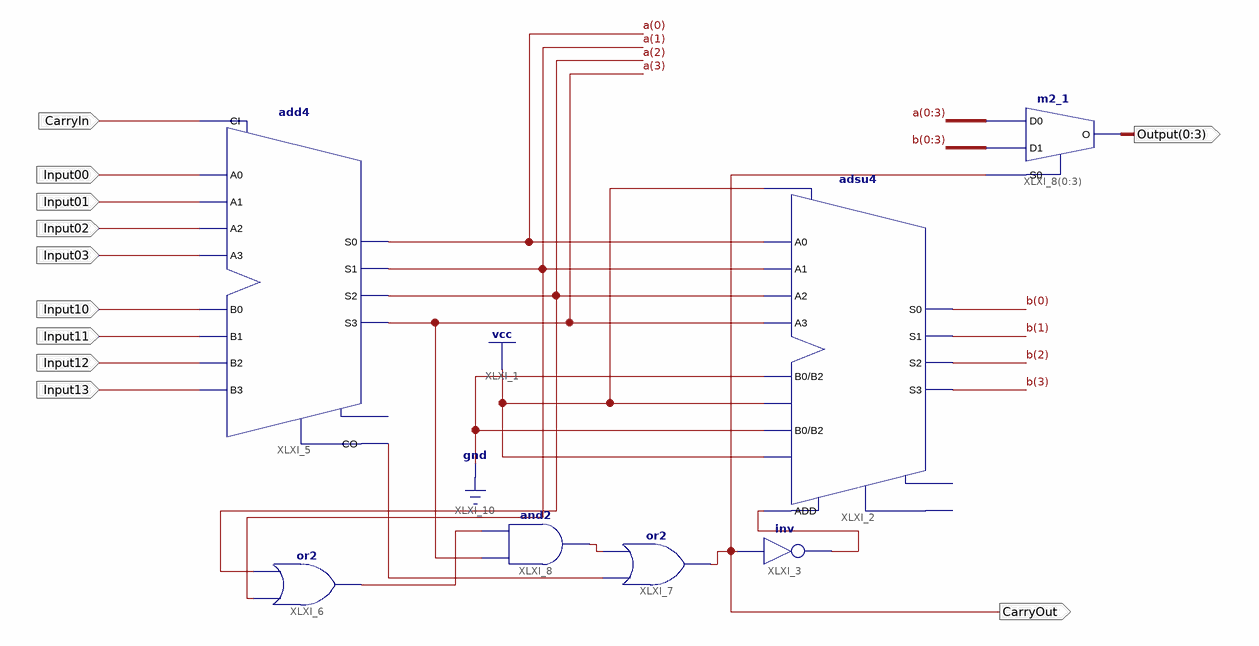
[diagram p0: schematic sheet 1]
// Xilinx ISE schematic Add2.sch (spartan6) as structural Verilog: 7 symbols, 11 ports
module Add2 (
  input  Input00,
  input  Input01,
  input  Input02,
  input  Input03,
  input  Input10,
  input  Input11,
  input  Input12,
  input  Input13,
  input  CarryIn,
  output [0:3] Output,
  output CarryOut
);

  wire XLXN_6, XLXN_7, XLXN_17, XLXN_33;
  wire [3:0] a, b;

  adsu4 XLXI_2 (
    .A0(a[0]), .A1(a[1]), .A2(a[2]), .A3(a[3]), .ADD(XLXN_7), .B0(1'b0), .B1(1'b1), .B2(1'b0), .B3(1'b1),
    .CI(1'b1), .S0(b[0]), .S1(b[1]), .S2(b[2]), .S3(b[3]));  // open: CO, OFL
  not XLXI_3 (XLXN_7, CarryOut);
  m2_1 XLXI_8[0:3] (.D0({a[0], a[1], a[2], a[3]}), .D1({b[0], b[1], b[2], b[3]}), .S0(CarryOut), .O(Output));
  add4 XLXI_5 (
    .A0(Input00), .A1(Input01), .A2(Input02), .A3(Input03), .B0(Input10), .B1(Input11), .B2(Input12),
    .B3(Input13), .CI(CarryIn), .CO(XLXN_6), .S0(a[0]), .S1(a[1]), .S2(a[2]), .S3(a[3]));  // open: OFL
  or XLXI_6 (XLXN_33, a[1], a[2]);
  or XLXI_7 (CarryOut, XLXN_6, XLXN_17);
  and XLXI_8_dup2 (XLXN_17, a[3], XLXN_33);
endmodule
